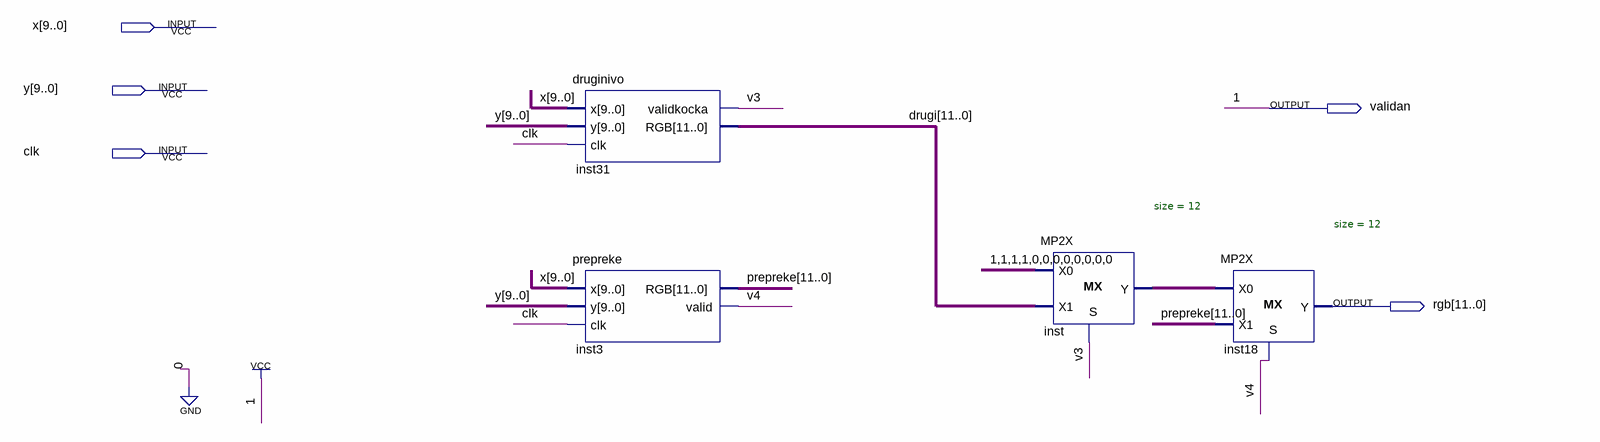
[diagram p0: schematic sheet]
// Quartus schematic trecinivo.bdf as structural Verilog: 4 symbols, 5 pins
module trecinivo (
  input  [9:0] x,
  input  [9:0] y,
  input  clk,
  output validan,
  output [11:0] rgb
);

  wire v3, v4;
  wire [11:0] drugi, inst_y, prepreke;

  druginivo inst31 (.x(x), .y(y), .clk(clk), .validkocka(v3), .RGB(drugi));
  prepreke inst3 (.x(x), .y(y), .clk(clk), .RGB(prepreke), .valid(v4));
  MP2X #(.size(12)) inst (.S(v3), .X0(12'b111100000000), .X1(drugi), .Y(inst_y));
  MP2X #(.size(12)) inst18 (.S(v4), .X0(inst_y), .X1(prepreke), .Y(rgb));

  assign validan = 1'b1;
endmodule
